# Altium schematic sheet 05_ZYNQ_PS.SchDoc
size A3; SheetNumber: 5; SheetTotal: 9
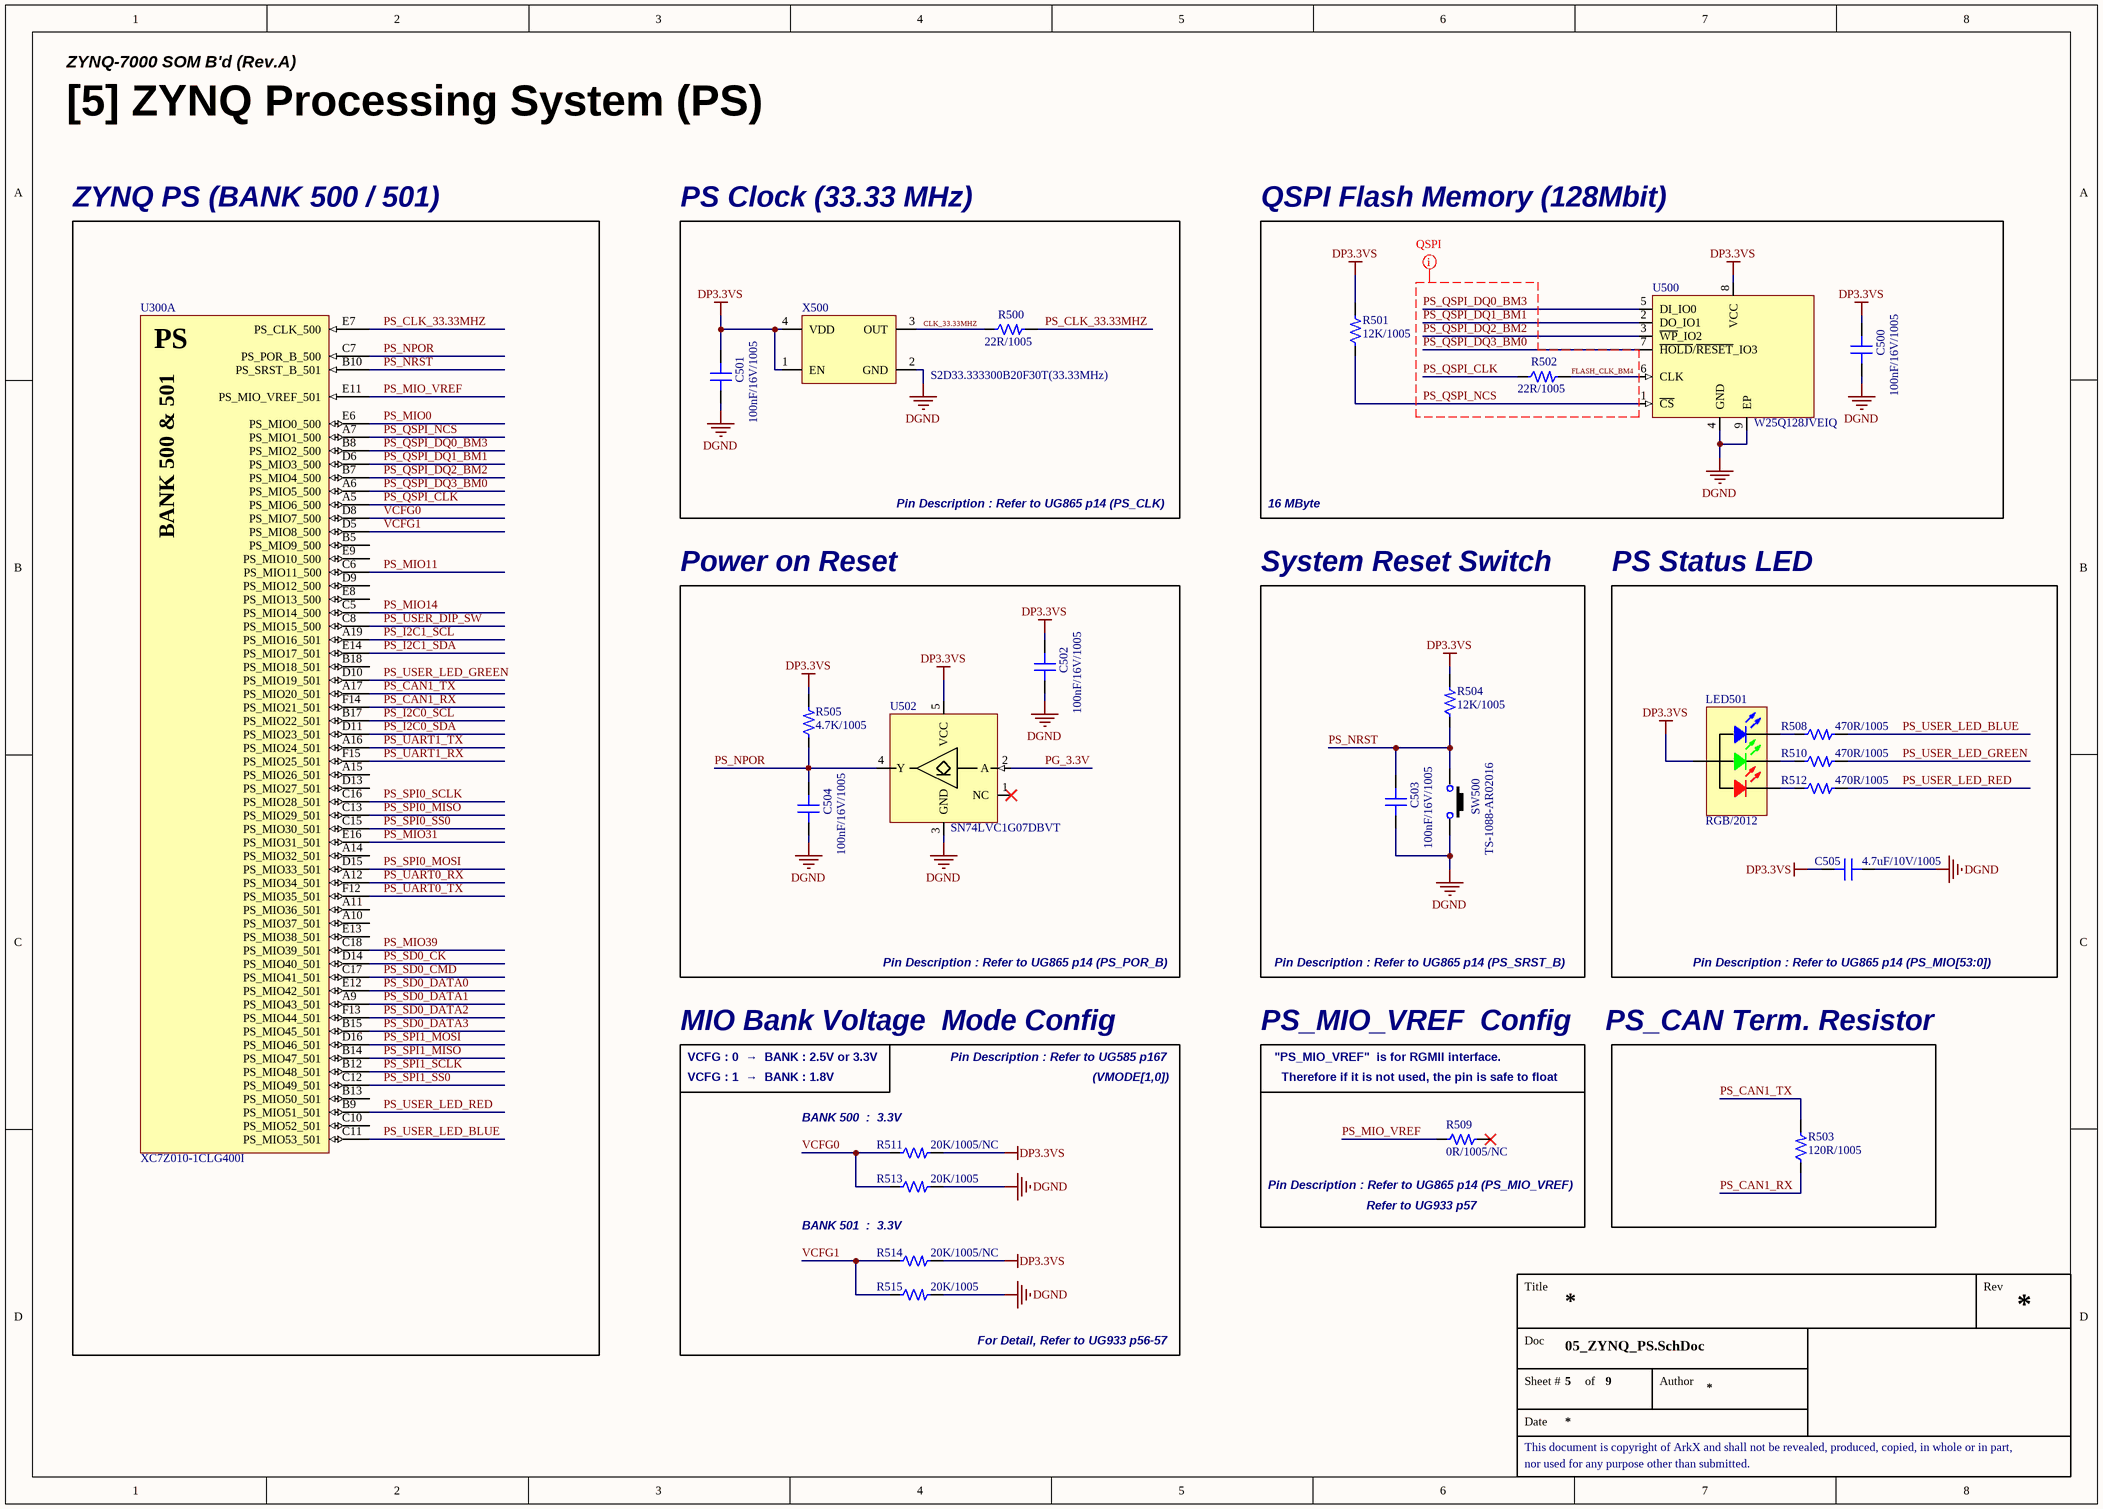
[diagram p0: 05_ZYNQ_PS.SchDoc]

## Parts
C500  100nF/16V/1005  [CAP 1005 (0402_INCH)]
C501  100nF/16V/1005  [CAP 1005 (0402_INCH)]
C502  100nF/16V/1005  [CAP 1005 (0402_INCH)]
C503  100nF/16V/1005  [CAP 1005 (0402_INCH)]
C504  100nF/16V/1005  [CAP 1005 (0402_INCH)]
C505  4.7uF/10V/1005  [CAP 1005 (0402_INCH)]
LED501  RGB/2012  [LED MHT170RGBCT]
R500  22R/1005  [RES 1005 (0402_inch)]
R501  12K/1005  [RES 1005 (0402_inch)]
R502  22R/1005  [RES 1005 (0402_inch)]
R503  120R/1005  [RES 1005 (0402_inch)]
R504  12K/1005  [RES 1005 (0402_inch)]
R505  4.7K/1005  [RES 1005 (0402_inch)]
R508  470R/1005  [RES 1005 (0402_inch)]
R509  0R/1005/NC  [RES 1005 (0402_inch)/NC]
R510  470R/1005  [RES 1005 (0402_inch)]
R511  20K/1005/NC  [RES 1005 (0402_inch)/NC]
R512  470R/1005  [RES 1005 (0402_inch)]
R513  20K/1005  [RES 1005 (0402_inch)]
R514  20K/1005/NC  [RES 1005 (0402_inch)/NC]
R515  20K/1005  [RES 1005 (0402_inch)]
SW500  TS-1088-AR02016  [SW_TS-1088-AR02016]
U300  XC7Z010-1CLG400I  [IC_SOC_XC7Z010-1CLG400I]  (part A of 9)
U500  W25Q128JVEIQ  [IC_WSON-8-8X6]
U502  SN74LVC1G07DBVT  [SOT-23-5 (TI DBV PACKAGE)]
X500  S2D33.333300B20F30T(33.33MHz)  [OSC SMD_2.5x2.0 (SCTF)]

## Blocks framed on the sheet
ZYNQ PS (BANK 500 / 501): U300
PS Clock (33.33 MHz): C501 R500 X500
QSPI Flash Memory (128Mbit): C500 R501 R502 U500
Power on Reset: C502 C504 R505 U502
System Reset Switch: C503 R504 SW500
PS Status LED: C505 LED501 R508 R510 R512
MIO Bank Voltage  Mode Config: R511 R513-R515
PS_MIO_VREF  Config: R509

## Nets
DGND: C500.2 C501.2 C502.2 C503.2 C504.2 C505.1 R513.2 R515.2 SW500.2 U500.4(GND) U500.9(EP) U502.3(GND) X500.2(GND)
DP3.3VS: C500.1 C501.1 C502.1 C505.2 LED501.4(Common_Anode) R501.2 R504.2 R505.2 R511.2 R514.2 U500.8(VCC) U502.5(VCC) X500.1(EN) X500.4(VDD)
CLK_33.33MHZ: R500.1 X500.3(OUT)
FLASH_CLK_BM4: R502.2 U500.6(CLK)
PG_3.3V: U502.2(A)
PS_CAN1_RX: R503.1 U300.F14(PS_MIO21_501)
PS_CAN1_TX: R503.2 U300.A17(PS_MIO20_501)
PS_CLK_33.33MHZ: R500.2 U300.E7(PS_CLK_500)
PS_I2C0_SCL: U300.B17(PS_MIO22_501)
PS_I2C0_SDA: U300.D11(PS_MIO23_501)
PS_I2C1_SCL: U300.A19(PS_MIO16_501)
PS_I2C1_SDA: U300.E14(PS_MIO17_501)
PS_MIO0: U300.E6(PS_MIO0_500)
PS_MIO11: U300.C6(PS_MIO11_500)
PS_MIO14: U300.C5(PS_MIO14_500)
PS_MIO31: U300.E16(PS_MIO31_501)
PS_MIO39: U300.C18(PS_MIO39_501)
PS_MIO_VREF: R509.1 U300.E11(PS_MIO_VREF_501)
PS_NPOR: C504.1 R505.1 U300.C7(PS_POR_B_500) U502.4(Y)
PS_NRST: C503.1 R504.1 SW500.1 U300.B10(PS_SRST_B_501)
PS_QSPI_CLK: R502.1 U300.A5(PS_MIO6_500)
PS_QSPI_DQ0_BM3: U300.B8(PS_MIO2_500) U500.5(DI_IO0)
PS_QSPI_DQ1_BM1: U300.D6(PS_MIO3_500) U500.2(DO_IO1)
PS_QSPI_DQ2_BM2: U300.B7(PS_MIO4_500) U500.3(~{WP}_IO2)
PS_QSPI_DQ3_BM0: U300.A6(PS_MIO5_500) U500.7(~{HOLD}/~{RESET}_IO3)
PS_QSPI_NCS: R501.1 U300.A7(PS_MIO1_500) U500.1(~{CS})
PS_SD0_CK: U300.D14(PS_MIO40_501)
PS_SD0_CMD: U300.C17(PS_MIO41_501)
PS_SD0_DATA0: U300.E12(PS_MIO42_501)
PS_SD0_DATA1: U300.A9(PS_MIO43_501)
PS_SD0_DATA2: U300.F13(PS_MIO44_501)
PS_SD0_DATA3: U300.B15(PS_MIO45_501)
PS_SPI0_MISO: U300.C13(PS_MIO29_501)
PS_SPI0_MOSI: U300.D15(PS_MIO33_501)
PS_SPI0_SCLK: U300.C16(PS_MIO28_501)
PS_SPI0_SS0: U300.C15(PS_MIO30_501)
PS_SPI1_MISO: U300.B14(PS_MIO47_501)
PS_SPI1_MOSI: U300.D16(PS_MIO46_501)
PS_SPI1_SCLK: U300.B12(PS_MIO48_501)
PS_SPI1_SS0: U300.C12(PS_MIO49_501)
PS_UART0_RX: U300.A12(PS_MIO34_501)
PS_UART0_TX: U300.F12(PS_MIO35_501)
PS_UART1_RX: U300.F15(PS_MIO25_501)
PS_UART1_TX: U300.A16(PS_MIO24_501)
PS_USER_DIP_SW: U300.C8(PS_MIO15_500)
PS_USER_LED_BLUE: R508.2 U300.C11(PS_MIO53_501)
PS_USER_LED_GREEN: R510.2 U300.D10(PS_MIO19_501)
PS_USER_LED_RED: R512.2 U300.B9(PS_MIO51_501)
VCFG0: R511.1 R513.1 U300.D8(PS_MIO7_500)
VCFG1: R514.1 R515.1 U300.D5(PS_MIO8_500)
NetLED501_1: LED501.1(RED) R512.1
NetLED501_2: LED501.2(GREEN) R510.1
NetLED501_3: LED501.3(BLUE) R508.1

Not connected (* = marked no-connect by the designer): R509 2*; U300 A10(PS_MIO37_501) A11(PS_MIO36_501) A14(PS_MIO32_501) A15(PS_MIO26_501) B5(PS_MIO9_500) B13(PS_MIO50_501) B18(PS_MIO18_501) C10(PS_MIO52_501) D9(PS_MIO12_500) D13(PS_MIO27_501) E8(PS_MIO13_500) E9(PS_MIO10_500) E13(PS_MIO38_501); U502 1(NC)*

## Layout directives
rule Matched Net Lengths [Delay Tolerance = 20ps]; net class QSPI: FLASH_CLK_BM4, PS_QSPI_CLK, PS_QSPI_DQ0_BM3, PS_QSPI_DQ1_BM1, PS_QSPI_DQ2_BM2, PS_QSPI_DQ3_BM0, PS_QSPI_NCS

## Notes on the sheet
- ZYNQ-7000 SOM B'd (Rev.A)
- [5] ZYNQ Processing System (PS)
- Pin Description : Refer to UG865 p14 (PS_CLK)
- 16 MByte
- Pin Description : Refer to UG865 p14 (PS_POR_B)
- Pin Description : Refer to UG865 p14 (PS_SRST_B)
- Pin Description : Refer to UG865 p14 (PS_MIO[53:0])
- PS_CAN Term. Resistor
- VCFG : 0  →  BANK : 2.5V or 3.3V
- VCFG : 1  →  BANK : 1.8V
- (near R511) BANK 500  :  3.3V
- Pin Description : Refer to UG585 p167
- (VMODE[1,0])
- "PS_MIO_VREF"  is for RGMII interface.
- Therefore if it is not used, the pin is safe to float
- (near R509) Pin Description : Refer to UG865 p14 (PS_MIO_VREF)
- BANK 501  :  3.3V
- Refer to UG933 p57
- For Detail, Refer to UG933 p56-57
- Title
- Rev
- Doc
- Sheet #
- of
- Author
- This document is copyright of ArkX and shall not be revealed, produced, copied, in whole or in part,
- Date
- nor used for any purpose other than submitted.
- (in symbol IC_SOC_XC7Z010-1CLG400I, part A) PS; BANK 500 & 501

## Library data of the parts
C500-C504 = CAP_100nF/16V/1005: Ceramic CAP_100nF/16V/1005; LCSC Part #: C1525; JLCPCB Part Type: Basic Part
C505 = CAP_4.7uF/10V/1005: 10V 4.7uF X5R ±20% 0402  Multilayer Ceramic Capacitors MLCC - SMD/SMT ROHS; JLCPCB Part Type: Basic Part; LCSC Part #: C23733
LED501 = LED_RGB_MHT170RGBCT: Colorless transparence -30℃~+85℃ Positive post Common anode RGB 120° 0805  Light Emitting Diodes (LED) ROHS; LCSC Part #: C2962094; JLCPCB Part Type: Extended Part
R500 R502 = RES_22R/1005/62.5mW: Value: 22R; Power Rating: 62.5mW; Precision: 1%; Size: 1005; LCSC Part #: C25092; JLCPCB Part Type: Basic Part
R501 R504 = RES_12K/1005/62.5mW: Value: 12K; Power Rating: 62.5mW; Precision: 1%; Size: 1005; LCSC Part #: C25752; JLCPCB Part Type: Basic Part
R503 = RES_120R/1005/62.5mW: Value: 120R; Power Rating: 62.5mW; Precision: 1%; Size: 1005; LCSC Part #: C25079; JLCPCB Part Type: Basic Part
R505 = RES_4.7K/1005/62.5mW: Value: 4.7K; Power Rating: 62.5mW; Precision: 1%; Size: 1005; LCSC Part #: C25900; JLCPCB Part Type: Basic Part
R508 R510 R512 = RES_470R/1005/62.5mW: Value: 470R; Power Rating: 62.5mW; Precision: 1%; Size: 1005; LCSC Part #: C25117; JLCPCB Part Type: Basic Part
R509 = RES_NC_0R/1005/62.5mW: RES_0R/1005/62.5mW/NC; Value: 0R; Power Rating: 62.5mW; Precision: 1%; Size: 1005
R511 R514 = RES_NC_20K/1005/62.5mW: RES_20K/1005/62.5mW/NC; Value: 20K; Power Rating: 62.5mW; Precision: 1%; Size: 1005
R513 R515 = RES_20K/1005/62.5mW: Value: 20K; Power Rating: 62.5mW; Precision: 1%; Size: 1005; LCSC Part #: C25765; JLCPCB Part Type: Basic Part
SW500 = SW_TS-1088-AR02016: NO 50mA 100MΩ 100000 Times 12V 160gf@±50gf Brick nogging SPST SMD  Tactile Switches ROHS; LCSC Part #: C720477; JLCPCB Part Type: Extended Part
U300 = IC_SOC_XC7Z010-1CLG400I: Dual ARM® Cortex®-A9 MPCore™ with CoreSight™ System On Chip (SOC) IC Zynq®-7000 Artix™-7 FPGA, 28K Logic Cells 766MHz 400-CSPBGA (17x17); LCSC Part #: C2840994; JLCPCB Part Type: Extended Part
U500 = IC_MEM_W25Q128JVEIQ: 3V 128M-BIT SERIAL FLASH MEMORY WITH DUAL/QUAD SPI & QPI & DTR WSON-8; Manufacturer: Winbond; Manufacturer Part Number: W25Q128JVEIQ; LCSC Part #: C401662; JLCPCB Part Type: Extended Part
U502 = IC_BUF_SN74LVC1G07DBVT: Single Buffer/Driver With Open-Drain Output / IC BUF NON-INVERT 5.5V SOT23-5; LCSC Part #: C2867373; JLCPCB Part Type: Extended Part
X500 = OSC_S2D33.333300B20F30T(33.33MHz): 3.3V ±20ppm CMOS 33.3333MHz SMD2520-4P  Oscillators ROHS; LCSC Part #: C907622; JLCPCB Part Type: Extended Part